# Altium project SimpleNode.PrjPCB
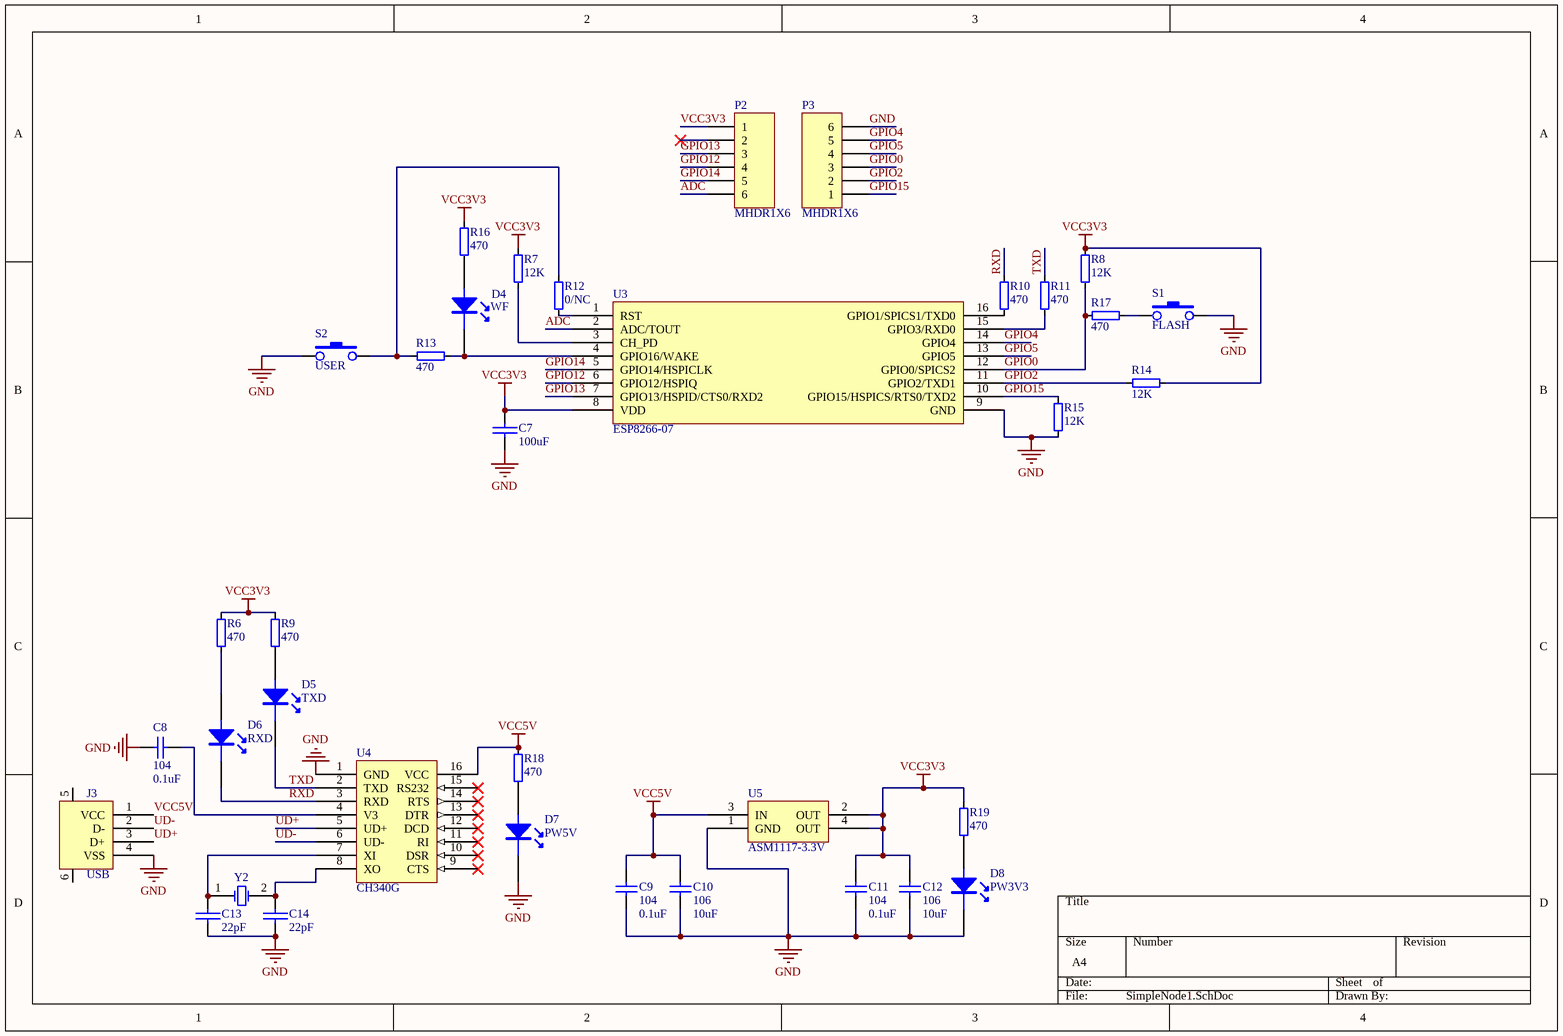
[diagram p0: SimpleNode1.SchDoc]
2 sheets, 55 parts. Net scope: global (net labels, ports and power ports of the same name join across sheets).
Board file: SimpleNode1.PcbDoc
Sheets:
  SimpleNode1.SchDoc
  SimpleNode2.SchDoc

## Sheet SimpleNode1.SchDoc
size A4

### Parts
(Parts that share a designator on the sheet are numbered #1, #2 ... from top to bottom, then left to right.)
C7#1  100uF  [C-RAD-0603]
C8  104  value 0.1uF  [C-RAD-0603]
C9  104  value 0.1uF  [C-RAD-0603]
C10  106  value 10uF  [C-RAD-0603]
C11  104  value 0.1uF  [C-RAD-0603]
C12  106  value 10uF  [C-RAD-0603]
C13  22pF  [C-RAD-0603]
C14  22pF  [C-RAD-0603]
D4#1  WF  [CD1608-0603]
D5  TXD  [CD1608-0603]
D6  RXD  [CD1608-0603]
D7  PW5V  [CD1608-0603]
D8  PW3V3  [CD1608-0603]
J3  USB  [USB_A1]
P2  MHDR1X6  [MHDR1X6]
P3  MHDR1X6  [MHDR1X6]
R6  470  [0603-1]
R7  12K  [0603-1]
R8  12K  [0603-1]
R9  470  [0603-1]
R10  470  [0603-1]
R11  470  [0603-1]
R12  0/NC  [0603-1]
R13  470  [0603-1]
R14  12K  [0603-1]
R15  12K  [0603-1]
R16  470  [0603-1]
R17  470  [0603-1]
R18  470  [0603-1]
R19  470  [0603-1]
S1  FLASH  [Switch-6-6-5]
S2  USER  [Switch-6-6-5]
U3  ESP8266-07  [ESP07-16P]
U4  CH340G  [SOP-16_N]
U5  ASM1117-3.3V  [SOT-223]
Y2  XTAL  [HC-49S]  (value not drawn)

### Nets
GND: C7#1.2 C8.2 C9.1 C10.1 C11.1 C12.1 C13.2 C14.2 D7.K D8.K J3.4(VSS) P3.6 R15.1 S1.2 S2.1 U3.9(GND) U4.1(GND) U5.1(GND)
VCC3V3: C7#1.1 C11.2 C12.2 P2.1 R6.2 R7.2 R8.1 R9.2 R14.1 R16.2 R19.2 U3.8(VDD) U5.2(OUT) U5.4(OUT)
VCC5V: C9.2 C10.2 J3.1(VCC) R18.2 U4.16(VCC) U5.3(IN)
ADC: P2.6 U3.2(ADC/TOUT)
GPIO0: P3.3 R8.2 R17.2 U3.12(GPIO0/SPICS2)
GPIO2: P3.2 R14.2 U3.11(GPIO2/TXD1)
GPIO4: P3.5 U3.14(GPIO4)
GPIO5: P3.4 U3.13(GPIO5)
GPIO12: P2.4 U3.6(GPIO12/HSPIQ)
GPIO13: P2.3 U3.7(GPIO13/HSPID/CTS0/RXD2)
GPIO14: P2.5 U3.5(GPIO14/HSPICLK)
GPIO15: P3.1 R15.2 U3.10(GPIO15/HSPICS/RTS0/TXD2)
RXD: D6.K R10.2 U4.3(RXD)
TXD: D5.K R11.2 U4.2(TXD)
UD+: J3.3(D+) U4.5(UD+)
UD-: J3.2(D-) U4.6(UD-)
NetC8_1: C8.1 U4.4(V3)
NetC13_1: C13.1 U4.7(XI) Y2.1(OSC1)
NetC14_1: C14.1 U4.8(XO) Y2.2(OSC2)
NetD4#1_A: D4#1.A R16.1
NetD4#1_K: D4#1.K R13.1 U3.4(GPIO16/WAKE)
NetD5_A: D5.A R9.1
NetD6_A: D6.A R6.1
NetD7_A: D7.A R18.1
NetD8_A: D8.A R19.1
NetR7_1: R7.1 U3.3(CH_PD)
NetR10_1: R10.1 U3.16(GPIO1/SPICS1/TXD0)
NetR11_1: R11.1 U3.15(GPIO3/RXD0)
NetR12_1: R12.1 U3.1(RST)
NetR12_2: R12.2 R13.2 S2.2
NetR17_1: R17.1 S1.1

Not connected (* = marked no-connect by the designer): J3 5 6; P2 2*; U4 9(CTS)* 10(DSR)* 11(RI)* 12(DCD)* 13(DTR)* 14(RTS)* 15(RS232)*

### Library data of the parts
C7#1 C13 C14 = 普通电容: Capacitor
C8-C12 = C0603: Ceramic Chip Capacitor - Standard; Note: Footprint corresponds to dimensions for bulk cassette packaging. This case size has tightened tolerances.; Published: 17-Jul-2002; LatestRevisionDate: 19-Mar-2004; LatestRevisionNote: Silkscreen size reduced.; DatasheetDocument: Mar-2001; PackageDocument: Mar-2001; PackageReference: 0603; Publisher: Altium Limited; Code_JEITA: 0603; Code_IPC: 1608 [0603]; ComponentLink1Description: Manufacturer Link; ComponentLink1URL: http://www.kemet.com/; ComponentLink2Description: Datasheet; ComponentLink2URL: http://www.kemet.com/kemet/web/homepage/kechome.nsf/vapubfilesname/F3102TA.pdf/$file/F3102TA.pdf
D4#1 D5-D8 = 发光二极管: pin to pad: A>1 K>2
J3 = USB: USB接口
P2 P3 = MHDR1X6: Header, 6-Pin; LatestRevisionDate: 17-Jul-2002; LatestRevisionNote: Re-released for DXP Platform.; Publisher: Altium Limited
R6-R19 = RES
S1 S2 = KEY
U5 = ASM1117: 3.3V稳压芯片
Y2 = XTAL: Crystal Oscillator; Published: 8-Jun-2000; LatestRevisionDate: 17-Jul-2002; LatestRevisionNote: Re-released for DXP Platform.; Publisher: Altium Limited

## Sheet SimpleNode2.SchDoc
size A4
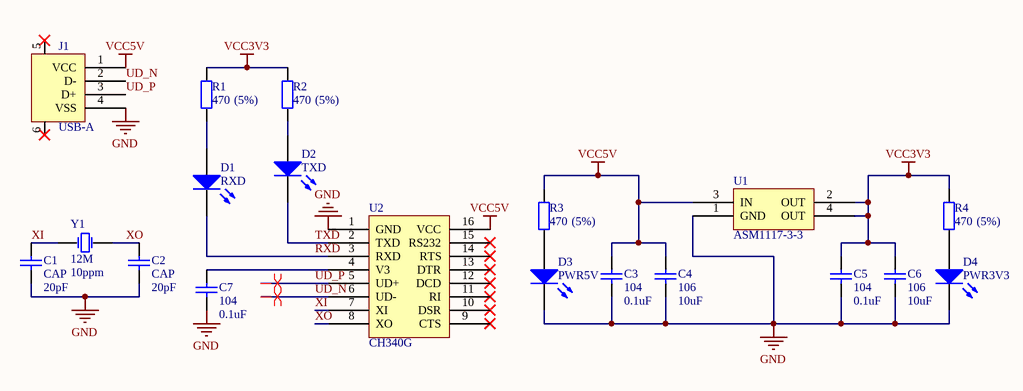
[diagram p1: SimpleNode2.SchDoc]

### Parts
(Parts that share a designator on the sheet are numbered #1, #2 ... from top to bottom, then left to right.)
C1  CAP  value 20pF  [C0603]
C2  CAP  value 20pF  [C0603]
C3  104  value 0.1uF  [C0603]
C4  106  value 10uF  [C0603]
C5  104  value 0.1uF  [C0603]
C6  106  value 10uF  [C0603]
C7#2  104  value 0.1uF  [C0603]
D1  RXD  [LED0603]
D2  TXD  [LED0603]
D3  PWR5V  [LED0603]
D4#2  PWR3V3  [LED0603]
J1  USB-A  [USB-A 公头]
R1  470  value (5%)  [R0603]
R2  470  value (5%)  [R0603]
R3  470  value (5%)  [R0603]
R4  470  value (5%)  [R0603]
U1  ASM1117-3-3  [SOT-223]
U2  CH340G  [SOP16]
Y1  12M  value 10ppm  [HC-49S]

### Nets
GND: C1.1 C2.1 C3.1 C4.1 C5.1 C6.1 C7#2.1 D3.2(K) D4#2.2(K) J1.4(VSS) U1.1(GND) U2.1(GND)
VCC3V3: C5.2 C6.2 R1.2 R2.2 R4.2 U1.2(OUT) U1.4(OUT)
VCC5V: C3.2 C4.2 J1.1(VCC) R3.2 U1.3(IN) U2.16(VCC)
RXD: D1.2(K) U2.3(RXD)
TXD: D2.2(K) U2.2(TXD)
UD_N: J1.2(D-) U2.6(UD-)
UD_P: J1.3(D+) U2.5(UD+)
XI: C1.2 U2.7(XI) Y1.1(OSC1)
XO: C2.2 U2.8(XO) Y1.2(OSC2)
NetC7#2_2: C7#2.2 U2.4(V3)
NetD1_1: D1.1(A) R1.1
NetD2_1: D2.1(A) R2.1
NetD3_1: D3.1(A) R3.1
NetD4#2_1: D4#2.1(A) R4.1

Not connected (* = marked no-connect by the designer): J1 5* 6*; U2 9(CTS)* 10(DSR)* 11(RI)* 12(DCD)* 13(DTR)* 14(RTS)* 15(RS232)*

### Layout directives
differential pair: UD_N, UD_P

### Library data of the parts
C1-C6 C7#2 = 贴片无极性电容
D1-D3 D4#2 = 贴片发光二级管
J1 = USB-A 公头
R1-R4 = 贴片电阻
U1 = ASM1117-3-3: 贴片5V转3.3V芯片
U2 = CH340G: 贴片USB转TTL
Y1 = 直插无源晶振

## Nets that join several sheets
GND: SimpleNode1 (18 pins), SimpleNode2 (12 pins)
VCC3V3: SimpleNode1 (14 pins), SimpleNode2 (7 pins)
VCC5V: SimpleNode1 (6 pins), SimpleNode2 (6 pins)
RXD: SimpleNode1 (D6.K R10.2 U4.3), SimpleNode2 (D1.2 U2.3)
TXD: SimpleNode1 (D5.K R11.2 U4.2), SimpleNode2 (D2.2 U2.2)